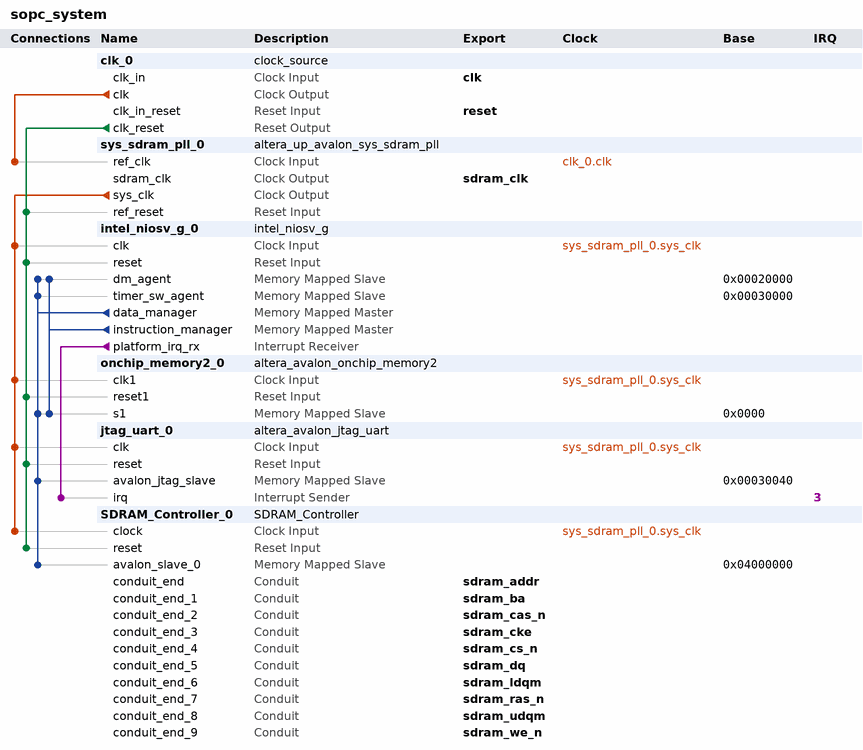
[diagram p0: system contents]
# Platform Designer (Qsys) system sopc_system, Cyclone V 5CSEMA5F31C6
# Parameters at their usual value, and those the tool derives, are not listed.
package require -exact qsys 23.1
create_system sopc_system
set_project_property DEVICE_FAMILY {Cyclone V}
set_project_property DEVICE 5CSEMA5F31C6

add_instance clk_0 clock_source 23.1
set_instance_parameter_value clk_0 clockFrequency 50000000

add_instance sys_sdram_pll_0 altera_up_avalon_sys_sdram_pll 18.0
set_instance_parameter_value sys_sdram_pll_0 CV_boards DE1-SoC
set_instance_parameter_value sys_sdram_pll_0 gui_outclk 50.0
set_instance_parameter_value sys_sdram_pll_0 gui_refclk 50.0

add_instance intel_niosv_g_0 intel_niosv_g 1.1.0
set_instance_parameter_value intel_niosv_g_0 clockFrequency 50000000
set_instance_parameter_value intel_niosv_g_0 dataCacheSize 4096
set_instance_parameter_value intel_niosv_g_0 disableFsqrtFdiv false
set_instance_parameter_value intel_niosv_g_0 dtcm1Base 0
set_instance_parameter_value intel_niosv_g_0 dtcm1Size 0
set_instance_parameter_value intel_niosv_g_0 dtcm2Base 0
set_instance_parameter_value intel_niosv_g_0 dtcm2Size 0
set_instance_parameter_value intel_niosv_g_0 enableDebug true
set_instance_parameter_value intel_niosv_g_0 enableDebugReset false
set_instance_parameter_value intel_niosv_g_0 enableECCLite false
set_instance_parameter_value intel_niosv_g_0 enableFPU false
set_instance_parameter_value intel_niosv_g_0 enableMulDiv true
set_instance_parameter_value intel_niosv_g_0 instCacheSize 4096
set_instance_parameter_value intel_niosv_g_0 itcm1Base 0
set_instance_parameter_value intel_niosv_g_0 itcm1Size 0
set_instance_parameter_value intel_niosv_g_0 itcm2Base 0
set_instance_parameter_value intel_niosv_g_0 itcm2Size 0
set_instance_parameter_value intel_niosv_g_0 peripheralRegionABase 0
set_instance_parameter_value intel_niosv_g_0 peripheralRegionASize 0
set_instance_parameter_value intel_niosv_g_0 peripheralRegionBBase 0
set_instance_parameter_value intel_niosv_g_0 peripheralRegionBSize 0
set_instance_parameter_value intel_niosv_g_0 resetOffset 0
set_instance_parameter_value intel_niosv_g_0 resetSlave onchip_memory2_0.s1
set_instance_parameter_value intel_niosv_g_0 useResetReq false

add_instance onchip_memory2_0 altera_avalon_onchip_memory2 23.1
set_instance_parameter_value onchip_memory2_0 dataWidth 32
set_instance_parameter_value onchip_memory2_0 dualPort false
set_instance_parameter_value onchip_memory2_0 initMemContent true
set_instance_parameter_value onchip_memory2_0 initializationFileName onchip_mem.hex
set_instance_parameter_value onchip_memory2_0 memorySize 131072

add_instance jtag_uart_0 altera_avalon_jtag_uart 23.1
set_instance_parameter_value jtag_uart_0 simInteractiveOptions NO_INTERACTIVE_WINDOWS

add_instance SDRAM_Controller_0 SDRAM_Controller 1.0

# connections
add_connection clk_0.clk sys_sdram_pll_0.ref_clk clock
add_connection sys_sdram_pll_0.sys_clk intel_niosv_g_0.clk clock
add_connection sys_sdram_pll_0.sys_clk jtag_uart_0.clk clock
add_connection sys_sdram_pll_0.sys_clk onchip_memory2_0.clk1 clock
add_connection sys_sdram_pll_0.sys_clk SDRAM_Controller_0.clock clock
add_connection clk_0.clk_reset intel_niosv_g_0.reset reset
add_connection clk_0.clk_reset jtag_uart_0.reset reset
add_connection clk_0.clk_reset onchip_memory2_0.reset1 reset
add_connection clk_0.clk_reset SDRAM_Controller_0.reset reset
add_connection clk_0.clk_reset sys_sdram_pll_0.ref_reset reset
add_connection intel_niosv_g_0.data_manager intel_niosv_g_0.dm_agent avalon
set_connection_parameter_value intel_niosv_g_0.data_manager/intel_niosv_g_0.dm_agent baseAddress 0x00020000
add_connection intel_niosv_g_0.data_manager intel_niosv_g_0.timer_sw_agent avalon
set_connection_parameter_value intel_niosv_g_0.data_manager/intel_niosv_g_0.timer_sw_agent baseAddress 0x00030000
add_connection intel_niosv_g_0.data_manager jtag_uart_0.avalon_jtag_slave avalon
set_connection_parameter_value intel_niosv_g_0.data_manager/jtag_uart_0.avalon_jtag_slave baseAddress 0x00030040
add_connection intel_niosv_g_0.data_manager onchip_memory2_0.s1 avalon
set_connection_parameter_value intel_niosv_g_0.data_manager/onchip_memory2_0.s1 baseAddress 0x0000
add_connection intel_niosv_g_0.data_manager SDRAM_Controller_0.avalon_slave_0 avalon
set_connection_parameter_value intel_niosv_g_0.data_manager/SDRAM_Controller_0.avalon_slave_0 baseAddress 0x04000000
add_connection intel_niosv_g_0.instruction_manager intel_niosv_g_0.dm_agent avalon
set_connection_parameter_value intel_niosv_g_0.instruction_manager/intel_niosv_g_0.dm_agent baseAddress 0x00020000
add_connection intel_niosv_g_0.instruction_manager onchip_memory2_0.s1 avalon
set_connection_parameter_value intel_niosv_g_0.instruction_manager/onchip_memory2_0.s1 baseAddress 0x0000
add_connection intel_niosv_g_0.platform_irq_rx jtag_uart_0.irq interrupt
set_connection_parameter_value intel_niosv_g_0.platform_irq_rx/jtag_uart_0.irq irqNumber 3

# exported interfaces
add_interface clk clock sink
set_interface_property clk EXPORT_OF clk_0.clk_in
add_interface reset reset sink
set_interface_property reset EXPORT_OF clk_0.clk_in_reset
add_interface sdram_addr conduit end
set_interface_property sdram_addr EXPORT_OF SDRAM_Controller_0.conduit_end
add_interface sdram_ba conduit end
set_interface_property sdram_ba EXPORT_OF SDRAM_Controller_0.conduit_end_1
add_interface sdram_cas_n conduit end
set_interface_property sdram_cas_n EXPORT_OF SDRAM_Controller_0.conduit_end_2
add_interface sdram_cke conduit end
set_interface_property sdram_cke EXPORT_OF SDRAM_Controller_0.conduit_end_3
add_interface sdram_clk clock source
set_interface_property sdram_clk EXPORT_OF sys_sdram_pll_0.sdram_clk
add_interface sdram_cs_n conduit end
set_interface_property sdram_cs_n EXPORT_OF SDRAM_Controller_0.conduit_end_4
add_interface sdram_dq conduit end
set_interface_property sdram_dq EXPORT_OF SDRAM_Controller_0.conduit_end_5
add_interface sdram_ldqm conduit end
set_interface_property sdram_ldqm EXPORT_OF SDRAM_Controller_0.conduit_end_6
add_interface sdram_ras_n conduit end
set_interface_property sdram_ras_n EXPORT_OF SDRAM_Controller_0.conduit_end_7
add_interface sdram_udqm conduit end
set_interface_property sdram_udqm EXPORT_OF SDRAM_Controller_0.conduit_end_8
add_interface sdram_we_n conduit end
set_interface_property sdram_we_n EXPORT_OF SDRAM_Controller_0.conduit_end_9

set_interconnect_requirement {$system} qsys_mm.clockCrossingAdapter HANDSHAKE
set_interconnect_requirement {$system} qsys_mm.enableEccProtection FALSE
set_interconnect_requirement {$system} qsys_mm.insertDefaultSlave FALSE
set_interconnect_requirement {$system} qsys_mm.maxAdditionalLatency 1

save_system sopc_system.qsys
